# EAGLE design 7seg_unit_smd (EAGLE 9.5.2)
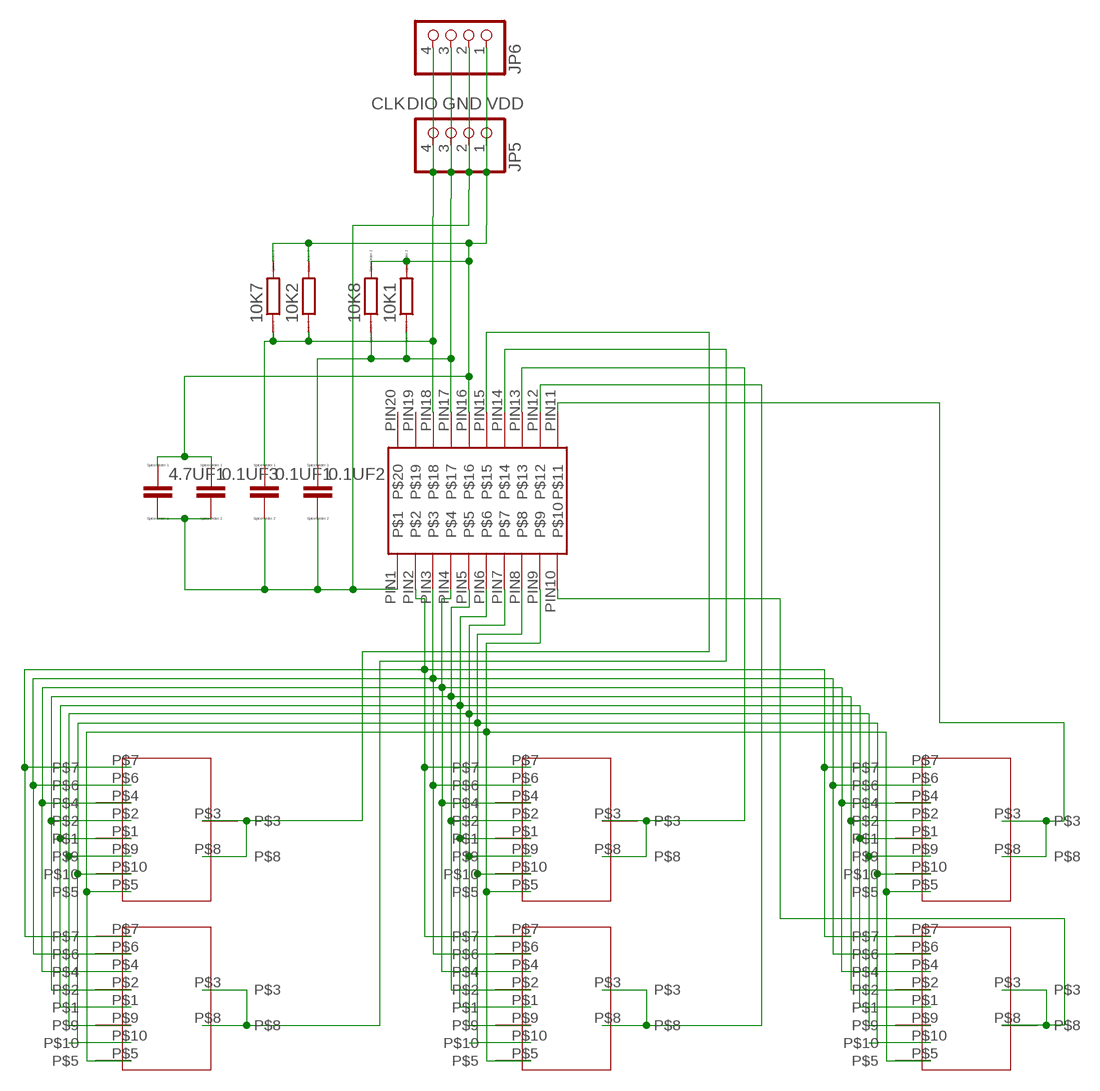
[diagram p0: schematic, sheet 1]

## Parts
0.1UF1  CC1206  [C1206]
0.1UF2  CC1206  [C1206]
0.1UF3  CC1206  [C1206]
4.7UF1  CC2012  [C2012]
7SEG_NEW1  7SEG_NEW  [7SEG_NEW]
7SEG_NEW2  7SEG_NEW  [7SEG_NEW]
7SEG_NEW3  7SEG_NEW  [7SEG_NEW]
7SEG_NEW4  7SEG_NEW  [7SEG_NEW]
7SEG_NEW5  7SEG_NEW  [7SEG_NEW]
7SEG_NEW6  7SEG_NEW  [7SEG_NEW]
10K1  RR1206  [R1206]
10K2  RR1206  [R1206]
10K7  RR1206  [R1206]
10K8  RR1206  [R1206]
JP5  PINHD-1X4  [1X04]
JP6  PINHD-1X4  [1X04]
TM1637-SMD1  TM1637  [TM1637]

## Nets
CLK: 0.1UF1.1 10K2.1 10K7.1 JP5.4 JP6.4 TM1637-SMD1.PIN18
DIO: 0.1UF2.1 10K1.1 10K8.1 JP5.3 JP6.3 TM1637-SMD1.PIN17
GND: 0.1UF1.2 0.1UF2.2 0.1UF3.2 4.7UF1.2 JP5.2 JP6.2 TM1637-SMD1.PIN1
N$5: 7SEG_NEW1.P$5 7SEG_NEW2.P$5 7SEG_NEW3.P$5 7SEG_NEW4.P$5 7SEG_NEW5.P$5 7SEG_NEW6.P$5 TM1637-SMD1.PIN9
N$6: 7SEG_NEW6.P$3 7SEG_NEW6.P$8 TM1637-SMD1.PIN10
N$7: 7SEG_NEW1.P$9 7SEG_NEW2.P$9 7SEG_NEW3.P$9 7SEG_NEW4.P$9 7SEG_NEW5.P$9 7SEG_NEW6.P$9 TM1637-SMD1.PIN7
N$8: 7SEG_NEW5.P$3 7SEG_NEW5.P$8 TM1637-SMD1.PIN11
N$9: 7SEG_NEW2.P$3 7SEG_NEW2.P$8 TM1637-SMD1.PIN12
N$10: 7SEG_NEW1.P$3 7SEG_NEW1.P$8 TM1637-SMD1.PIN13
N$11: 7SEG_NEW4.P$3 7SEG_NEW4.P$8 TM1637-SMD1.PIN14
N$12: 7SEG_NEW3.P$3 7SEG_NEW3.P$8 TM1637-SMD1.PIN15
N$22: 7SEG_NEW1.P$10 7SEG_NEW2.P$10 7SEG_NEW3.P$10 7SEG_NEW4.P$10 7SEG_NEW5.P$10 7SEG_NEW6.P$10 TM1637-SMD1.PIN8
N$24: 7SEG_NEW1.P$1 7SEG_NEW2.P$1 7SEG_NEW3.P$1 7SEG_NEW4.P$1 7SEG_NEW5.P$1 7SEG_NEW6.P$1 TM1637-SMD1.PIN6
N$25: 7SEG_NEW1.P$2 7SEG_NEW2.P$2 7SEG_NEW3.P$2 7SEG_NEW4.P$2 7SEG_NEW5.P$2 7SEG_NEW6.P$2 TM1637-SMD1.PIN5
N$26: 7SEG_NEW1.P$4 7SEG_NEW2.P$4 7SEG_NEW3.P$4 7SEG_NEW4.P$4 7SEG_NEW5.P$4 7SEG_NEW6.P$4 TM1637-SMD1.PIN4
N$27: 7SEG_NEW1.P$6 7SEG_NEW2.P$6 7SEG_NEW3.P$6 7SEG_NEW4.P$6 7SEG_NEW5.P$6 7SEG_NEW6.P$6 TM1637-SMD1.PIN3
N$28: 7SEG_NEW1.P$7 7SEG_NEW2.P$7 7SEG_NEW3.P$7 7SEG_NEW4.P$7 7SEG_NEW5.P$7 7SEG_NEW6.P$7 TM1637-SMD1.PIN2
VDD: 0.1UF3.1 4.7UF1.1 10K1.2 10K2.2 10K7.2 10K8.2 JP5.1 JP6.1 TM1637-SMD1.PIN16
Unconnected: TM1637-SMD1.PIN19 TM1637-SMD1.PIN20

## Library data of the parts
0.1UF1-0.1UF3 4.7UF1 = eagle-ltspice:C: CAPACITOR, European symbol; SPICEMODEL: NONE; SPICEPREFIX: C
7SEG_NEW1-7SEG_NEW6 = 7seg_KCSA56-105:7SEG_NEW: 7segLED(KCSA56-105)
10K1 10K2 10K7 10K8 = eagle-ltspice:R: RESISTOR, European symbol; SPICEMODEL: NONE; SPICEPREFIX: R
JP5 JP6 = pinhead:PINHD-1X4: PIN HEADER
TM1637-SMD1 = tm1637:TM1637: TM1637-smd library

## Net classes
0 default: width 0.4 mm, clearance 0.3 mm

## Board
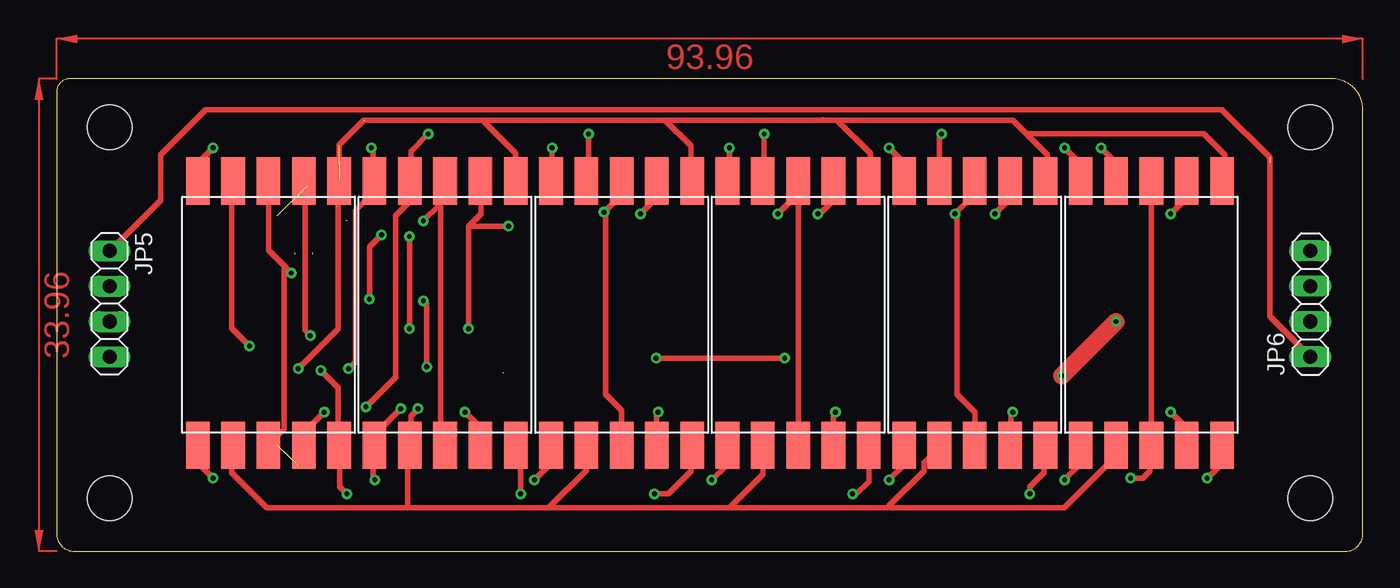
[diagram p1: board, top side]
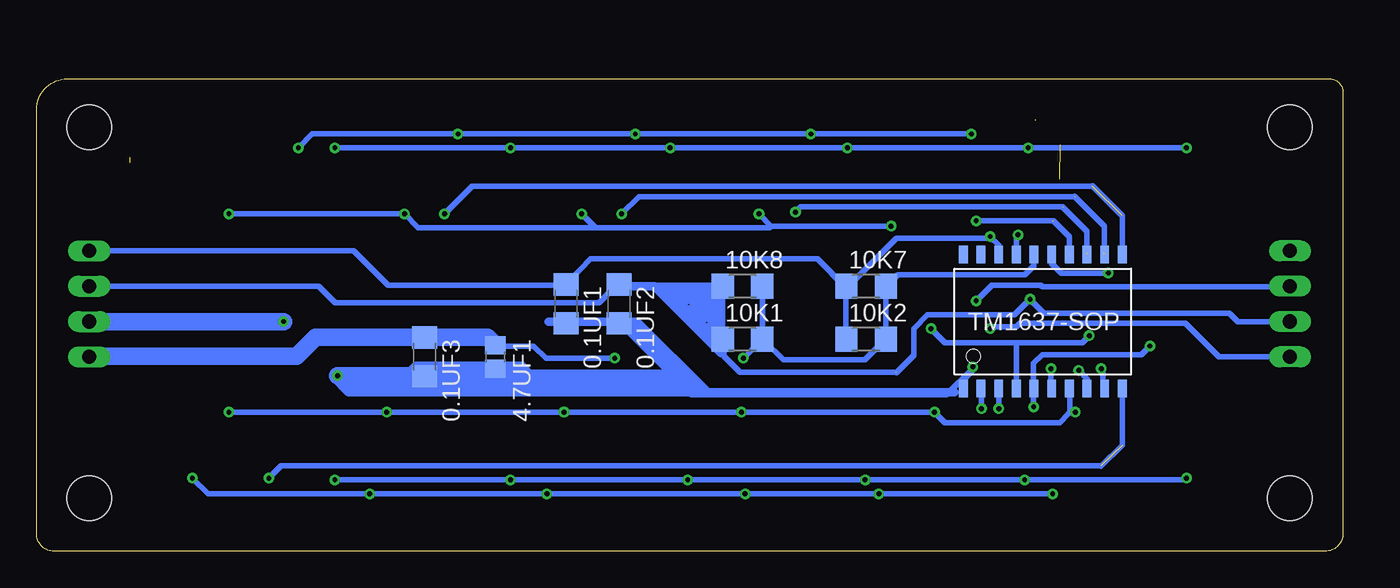
[diagram p2: board, bottom side, seen from below]

Size 93.96 x 33.96 mm. Coordinates in mm from the lower left corner, seen from the top.
Outline: 0,33.02 0,1.27 arc90 1.27,0 92.71,0 arc90 93.96,1.25 93.96,31.75 arc90 91.75,33.96 0.94,33.96 arc90 0,33.02
Copper layers (1*16): Top 0.035mm / dielectric 1.5mm / Bottom 0.035mm
Design rules "default": minimum track width 6mil, minimum drill 0.35mm, track to track 6mil, track to pad 6mil, pad to pad 6mil, via to via 6mil, smd to smd 6mil, copper to edge 40mil, drill to drill 6mil, minimum pad ring 10mil, minimum via ring 8mil, stop-mask expansion 4mil, vias tented up to drill 0mil, thermal gap 10mil
Holes 3.2 mm at 3.81,3.81 3.81,30.48 90.17,3.81 90.17,30.48

### Footprints (pad centres in the part's own frame; a part is rotated, then mirrored left to right if it is on the bottom)
C1206 = smd 1.6 x 1.8: 1 -1.4,0; 2 1.4,0
C2012 = smd 1.3 x 1.5: 1 -0.85,0; 2 0.85,0
7SEG_NEW = smd 1.7 x 3.4: P$1 -5.08,10.11; P$2 -2.54,10.11; P$3 0,10.11; P$4 2.54,10.11; P$5 5.08,10.11; P$6 -5.08,-8.89; P$7 -2.54,-8.89; P$8 0,-8.89; P$9 2.54,-8.89; P$10 5.08,-8.89
R1206 = smd 1.6 x 1.803: 1 -1.422,0; 2 1.422,0
1X04 = drill 1.016 long: 1 -3.81,0; 2 -1.27,0; 3 1.27,0; 4 3.81,0
TM1637 = smd 1.27 x 0.635: PIN1 -4.82,5.715; PIN2 -4.82,4.445; PIN3 -4.82,3.175; PIN4 -4.82,1.905; PIN5 -4.82,0.635; PIN6 -4.82,-0.635; PIN7 -4.82,-1.905; PIN8 -4.82,-3.175; PIN9 -4.82,-4.445; PIN10 -4.82,-5.715; PIN11 4.83,-5.715; PIN12 4.83,-4.445; PIN13 4.83,-3.175; PIN14 4.83,-1.905; PIN15 4.83,-0.635; PIN16 4.83,0.635; PIN17 4.83,1.905; PIN18 4.83,3.175; PIN19 4.83,4.445; PIN20 4.83,5.715

### Placement (x,y rotation side)
0.1UF1  55.88,17.78 270 bottom
0.1UF2  52.07,17.78 270 bottom
0.1UF3  66.04,13.97 270 bottom
4.7UF1  60.96,13.97 270 bottom
7SEG_NEW1  40.64,16.51 0 top
7SEG_NEW2  53.34,16.51 0 top
7SEG_NEW3  15.24,16.51 0 top
7SEG_NEW4  27.94,16.51 0 top
7SEG_NEW5  66.04,16.51 0 top
7SEG_NEW6  78.74,16.51 0 top
10K1  43.18,15.24 0 bottom
10K2  34.29,15.24 0 bottom
10K7  34.29,19.05 0 bottom
10K8  43.18,19.05 0 bottom
JP5  3.81,17.78 270 top
JP6  90.17,17.78 90 top
TM1637-SMD1  21.59,16.51 90 bottom

### Tracks (layer width: path | path; a pad name or v marks a point on that pad's centre or on a via)
CLK  (via drill 0.35)
  Top 0.4: v25.38,22.62 v25.38,16
  Bottom 0.4: 34.25,20.38 35.5,19.12 35.62,19.12 10K7.1 35.75,18.88 35.75,15.25 10K2.1 | 34.25,20.38 35.71,18.91 37.8,21.01 54.12,21.01 54.88,20.25 55.88,19.25 0.1UF1.1 55.95,19.11 68.68,19.11 71.17,21.59 JP6.4 | v25.38,16 25.25,16.12 23.5,16.12 23.25,16.38 11.33,16.38 8.93,13.97 JP5.4 | 34.25,20.38 32.12,22.5 25.38,22.5 v25.38,22.62 24.74,21.99 24.77,21.99 TM1637-SMD1.PIN18
DIO  (via drill 0.35)  (2 unrouted)
  Top 0.4: v23.38,22.75 22.5,21.88 v22.5,18.12
  Bottom 0.4: 30.86,16.01 29.88,17 23.62,17 22.62,18 v22.5,18.12 21.5,17.12 8.19,17.12 7.57,16.51 JP5.3 | 32.13,12.88 43.38,12.88 44.5,14 44.5,15.12 10K1.1 44.62,15.25 44.62,18.88 10K8.1 44.62,19.12 52,19.12 0.1UF2.1 52.25,19.12 53.5,17.88 72.49,17.88 73.67,19.05 JP6.3 | 32.13,12.83 30.86,14.1 30.86,16 | v23.38,22.75 23.5,22.62 TM1637-SMD1.PIN17
GND  (via drill 0.35)
  Top 0.4: v26.38,18 26.62,17.75 v26.62,13.25
  Top 1.27: v72.31,12.62 v76.2,16.51
  Bottom 0.4: 66.12,12.62 0.1UF3.2 66,12.62 61.38,12.62 61,13 4.7UF1.2 60.75,13.12 60.5,12.88 48.75,12.88 48.62,13 | 48.62,13 52,16.38 0.1UF2.2 52.25,16.38 0.1UF1.2 | 48.62,13 46.86,11.24 28.51,11.24 26.62,13.12 | v26.38,18 25.25,19.12 21.74,19.12 21.62,19 3.88,19 JP5.2 | 26.62,13.12 v26.62,13.25 | TM1637-SMD1.PIN1 27.3,12.19 27.37,12.25 26.62,13 26.62,13.12
  Bottom 1.27: 66.12,12.62 v72.31,12.62 | v76.2,16.51 JP6.2
N$2
  Bottom 0.61: 27.94,11.43 45.72,11.43 | 45.72,11.43 50.8,16.51 57.15,16.51 | 45.72,11.43 71.5,11.43 72.64,12.57 72.01,12.57 71.25,11.81 47.62,11.81
N$3
  Bottom 0.61: 52.07,16.26 51.18,16.26 46.35,11.43
N$4
  Bottom 0.61: 58.42,12.7 59.05,13.34 66.67,13.34 67.31,12.7 66.04,12.7 65.79,12.95 61.09,12.95
N$5  (via drill 0.35)  (2 unrouted)
  Top 0.4: v17.38,13.12 20.25,16 20.25,26.5 7SEG_NEW3.P$5 20.38,26.75 | 30.64,31 33.02,28.63 7SEG_NEW4.P$5 | 22.15,31 29.38,31 30.64,31 | 43.78,31 45.64,29.14 45.64,26.62 7SEG_NEW1.P$5 | 30.64,31 42.12,31 43.78,31 | 55.13,31 55.12,31 | 56.15,31 58.52,28.62 58.52,26.72 7SEG_NEW2.P$5 | 43.78,31 55.12,31 | 69.77,30 68.77,31 56.15,31 | 69.77,30 71.27,28.5 71.27,26.77 7SEG_NEW5.P$5 | 69.77,30 82.52,30 84.02,28.5 84.02,26.82 7SEG_NEW6.P$5 | 55.12,31 56.15,31 | 20.32,29.21 22.1,30.99 | 20.32,29.21 20.32,27.94 | 20.32,27.94 20.32,26.67 | 20.32,27.94 20.32,29.21
  Bottom 0.4: v17.38,13.12 17.25,13.12 17.25,11.75 TM1637-SMD1.PIN9
N$6  (via drill 0.35)  (1 unrouted)
  Top 0.4: 7SEG_NEW6.P$3 78.75,26.5 78.75,7.75 7SEG_NEW6.P$8 78.62,7.5 78.62,5.74 78.14,5.25 v77.25,5.25
  Bottom 0.4: 15.88,7.62 15.88,11.56 | 15.88,11.56 15.88,11.62 TM1637-SMD1.PIN10 | 17.4,6.12 76.38,6.12 v77.25,5.25 | 15.88,11.56 15.88,7.62 | 15.88,7.62 17.4,6.1
N$7  (via drill 0.35)
  Top 0.4: v19.25,10 17.88,8.62 17.88,7.62 7SEG_NEW3.P$9 | 7SEG_NEW4.P$9 30.39,7.62 30.39,8.98 v29.38,10 | 7SEG_NEW1.P$9 43.14,7.62 43.14,9.87 v43.27,10 | 7SEG_NEW2.P$9 55.89,7.64 55.89,9.87 v56.02,10 | 7SEG_NEW6.P$9 81.27,7.62 81.27,8.86 v80.12,10 | v68.77,10 68.64,9.87 68.64,7.68 7SEG_NEW5.P$9
  Bottom 0.4: 19.62,10 19.62,11.62 TM1637-SMD1.PIN7 | v19.25,10 19.62,10 | 19.62,10 19.75,9.88 20.38,9.25 28.62,9.25 v29.38,10 29.5,10 v43.27,10 42.12,10 v56.02,10 54.88,10 v68.77,10 67.62,10 v80.12,10
N$8  (via drill 0.35)  (1 unrouted)
  Top 0.4: 7SEG_NEW5.P$3 66,26.5 66,25.62 v64.62,24.25 64.75,24.25 64.75,11.29 66.04,10 7SEG_NEW5.P$8
  Bottom 0.4: 18.03,26.25 62.62,26.25 v64.62,24.25 | TM1637-SMD1.PIN11 15.88,21.38 15.88,21.46 15.88,24.13 18.03,26.29
N$9  (via drill 0.35)  (2 unrouted)
  Top 0.4: v51.88,24.25 53.25,25.62 53.25,26.5 7SEG_NEW2.P$3 53.38,25.5 53.38,7.62 7SEG_NEW2.P$8
  Bottom 0.4: 19.28,25.5 50.62,25.5 v51.88,24.25 | 17.25,21.38 TM1637-SMD1.PIN12 | 17.14,21.46 17.14,23.37 19.3,25.53
N$10  (via drill 0.35)  (2 unrouted)
  Top 0.4: 7SEG_NEW1.P$3 40.62,26.5 40.62,25.62 v39.38,24.38 39.5,24.25 39.5,11.29 40.64,10.15 7SEG_NEW1.P$8
  Bottom 0.4: 20.15,24.75 39,24.75 v39.38,24.38 | 18.5,21.38 TM1637-SMD1.PIN13 | 18.41,21.46 18.41,22.99 20.19,24.77
N$11  (via drill 0.35)  (2 unrouted)
  Top 0.4: 27.5,24.88 27.88,25.25 27.88,26.5 7SEG_NEW4.P$3 | 27.5,24.88 v26.38,23.75 | 7SEG_NEW4.P$8 27.88,7.62 27.62,7.88 27.62,24.75 27.5,24.88
  Bottom 0.4: v26.38,23.75 20.89,23.75 | 19.75,21.38 TM1637-SMD1.PIN14 | TM1637-SMD1.PIN14 19.68,22.61 20.83,23.75
N$12  (via drill 0.35)
  Top 0.4: 16.5,20.38 15.25,21.62 15.25,26.5 7SEG_NEW3.P$3 | 16.5,20.38 v16.88,20 | 7SEG_NEW3.P$8 16.38,8.75 16.38,20.25 16.5,20.38
  Bottom 0.4: v16.88,20 20.25,20 20.95,20.7 TM1637-SMD1.PIN15
N$13
  Bottom 0.6: 52.07,19.05 50.8,19.05 49.53,19.05 44.7,14.22
N$14
  Bottom 0.6: 48.77,18.92 45.21,15.37
N$22  (via drill 0.35)
  Top 0.4: v19,13 20.25,11.75 20.25,7.62 7SEG_NEW3.P$10 20.37,7.52 20.37,4.63 v20.88,4.12 | v33.38,4.12 33.38,7.25 33.12,7.5 7SEG_NEW4.P$10 | 7SEG_NEW1.P$10 45.62,7.5 45.62,5.73 44.02,4.12 v43,4.12 | 7SEG_NEW2.P$10 58.42,5 57.54,4.12 v57.25,4.12 | 7SEG_NEW5.P$10 71,7.5 71.02,7.48 71.02,5.65 70,4.63 v70,4.12 | v82.75,5.25 84.02,6.52 84.02,7.42 7SEG_NEW6.P$10
  Bottom 0.4: TM1637-SMD1.PIN8 18.5,11.75 18.5,12.37 18.36,12.37 v19,13 | v82.75,5.25 81.62,4.12 70.12,4.12 v70,4.12 57.38,4.12 v57.25,4.12 43.12,4.12 v43,4.12 v33.38,4.12 33.25,4.12 v20.88,4.12
N$24  (via drill 0.35)
  Top 0.4: v21,13.12 21.5,13.62 21.5,24.5 22.75,25.75 22.75,26.5 7SEG_NEW4.P$1 22.75,26.75 22.75,28.89 v22.64,29 | v35.65,29 35.65,26.7 7SEG_NEW1.P$1 | v11.25,29 9.98,27.73 9.98,26.8 7SEG_NEW3.P$1 | v72.5,29 73.77,27.73 73.77,26.73 7SEG_NEW6.P$1 | v48.4,29 48.4,26.75 7SEG_NEW2.P$1 | v59.88,29 61.15,27.73 61.15,26.8 7SEG_NEW5.P$1
  Bottom 0.4: v21,13.12 21,11.75 TM1637-SMD1.PIN6 | v11.25,29 v22.64,29 21.5,29 v35.65,29 34.5,29 v48.4,29 47.25,29 v59.88,29 60,29 v72.5,29
N$25  (via drill 0.35)
  Top 0.4: v22.25,10.38 24.38,12.5 24.38,24.1 25.3,25.02 25.4,25.53 7SEG_NEW4.P$2 25.5,26.75 25.5,28.77 v26.73,30 | v38.27,30 38.27,26.79 7SEG_NEW1.P$2 | v50.9,30 50.9,26.71 7SEG_NEW2.P$2 | 7SEG_NEW5.P$2 63.5,30 v63.65,30 | v75.12,29 76.39,27.73 76.39,26.82 7SEG_NEW6.P$2 | v13.88,14.75 12.61,16.02 12.61,26.52 7SEG_NEW3.P$2
  Bottom 0.4: v22.25,10.38 22.25,11.62 TM1637-SMD1.PIN5 22.25,11.85 22.25,13.5 21.62,14.12 14.5,14.12 v13.88,14.75 | v26.73,30 v38.27,30 37.12,30 v50.9,30 49.75,30 v63.65,30 62.5,30 74.12,30 v75.12,29
N$26  (via drill 0.35)
  Top 0.4: v18.25,15.5 17.88,15.88 17.88,26.5 7SEG_NEW3.P$4 | v29.62,16 29.62,23.38 29.75,23.38 | 29.75,23.38 v32.5,23.38 | 7SEG_NEW2.P$4 55.82,25.18 54.9,24.25 v54.75,24.25 | v67.5,24.25 68.58,25.33 7SEG_NEW5.P$4 | v42,24.25 43.27,25.52 43.27,26.53 7SEG_NEW1.P$4 | 7SEG_NEW4.P$4 30.51,26.59 30.51,24.27 29.62,23.38 29.75,23.38 | v80.12,24.25 81.39,25.52 81.39,26.5 7SEG_NEW6.P$4
  Bottom 0.4: 23.5,15 23.5,11.75 TM1637-SMD1.PIN4 | 23.5,15 18.75,15 v18.25,15.5 | v29.62,16 28.62,15 23.62,15 23.5,15 | 41.12,23.38 v42,24.25 | v32.5,23.38 41.12,23.38 | 53.75,23.25 53.88,23.38 v54.75,24.25 | 53.75,23.25 41.25,23.25 41.12,23.38 | 53.75,23.25 66.5,23.25 v67.5,24.25 67.62,24.25 v80.12,24.25
N$27  (via drill 0.35)
  Top 0.4: v24.75,10.25 22.88,8.38 22.88,7.62 7SEG_NEW4.P$6 22.75,7.5 22.75,5.27 v22.89,5.12 | 7SEG_NEW2.P$6 48.13,6.12 47.15,5.12 v47.12,5.12 | v72.5,5.12 73.77,6.39 73.77,7.51 7SEG_NEW6.P$6 | v59.88,5.12 61.15,6.39 61.15,7.43 7SEG_NEW5.P$6 | v34.38,5.12 35.65,6.39 35.65,7.54 7SEG_NEW1.P$6 | v11.25,5.25 10.19,6.31 10.16,6.35 7SEG_NEW3.P$6
  Bottom 0.4: v24.75,10.25 24.75,11.62 TM1637-SMD1.PIN3 | v11.25,5.25 11.38,5.12 v22.89,5.12 22,5.12 v34.38,5.12 34.5,5.12 v47.12,5.12 47.25,5.12 v59.88,5.12 60,5.12 v72.5,5.12
N$28  (via drill 0.35)
  Top 0.4: v26,10.25 25.5,9.75 25.5,7.62 7SEG_NEW4.P$7 25.25,7.5 25.25,3.12 | 25.25,3.12 15.11,3.12 12.61,5.62 12.61,7.53 7SEG_NEW3.P$7 | 35.39,3.12 25.38,3.12 25.25,3.12 | 35.39,3.12 38.1,5.83 7SEG_NEW1.P$7 | 48.4,3.12 50.8,5.53 7SEG_NEW2.P$7 | 35.39,3.12 47.12,3.12 48.4,3.12 | 59.88,3.25 59.75,3.12 48.4,3.12 | 59.88,3.25 62.38,5.75 62.38,6.38 63.5,7.5 7SEG_NEW5.P$7 | 7SEG_NEW6.P$7 76.12,7.5 75.76,7.13 75.76,6.38 72.5,3.12 60,3.12 59.88,3.25
  Bottom 0.4: v26,10.25 26,11.62 TM1637-SMD1.PIN2
VDD  (via drill 0.35)  (1 unrouted)
  Top 0.4: 87.25,27.94 87.25,16.88 90.12,14 JP6.1 | JP5.1 3.88,21.62 7.48,25.23 7.48,28.5 10.73,31.75 83.82,31.75 87.25,28.32 87.25,25.27 | v52.38,13.88 v43.12,13.88
  Bottom 0.4: 10K1.2 41.75,19 10K8.2 | 10K1.2 41.62,15.12 40.25,13.75 34.38,13.75 33,15.12 10K2.2 32.88,18.88 10K7.2 32.75,19.12 32,19.88 22.89,19.88 22.23,20.54 TM1637-SMD1.PIN16 | 90.12,14 JP6.1 | v43.12,13.88 41.88,15.12 10K1.2 | 4.7UF1.1 60.88,14.75 58.2,14.75 57.33,13.88 v52.38,13.88
  Bottom 1.27: 90.12,14 75.25,14 73.87,15.38 73.66,15.37 0.1UF3.1 61.52,15.38 4.7UF1.1
(copper drawn outside any net)
  shapes: Bottom area x5, Top area x2

### Text on the board
Document: VDD / / / GND / / / CLK / / / DIO | DIO / / / CLK / / / GND / / / VDD